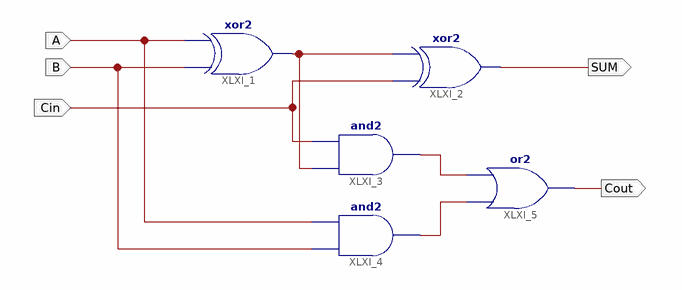
[diagram p0: schematic sheet 1]
// Xilinx ISE schematic FullAdder.sch (spartan6) as structural Verilog: 5 symbols, 5 ports
module FullAdder (
  input  Cin,
  input  B,
  input  A,
  output SUM,
  output Cout
);

  wire XLXN_1, XLXN_2, XLXN_3;

  xor XLXI_1 (XLXN_3, B, A);
  xor XLXI_2 (SUM, Cin, XLXN_3);
  and XLXI_3 (XLXN_1, XLXN_3, Cin);
  and XLXI_4 (XLXN_2, B, A);
  or XLXI_5 (Cout, XLXN_2, XLXN_1);
endmodule
